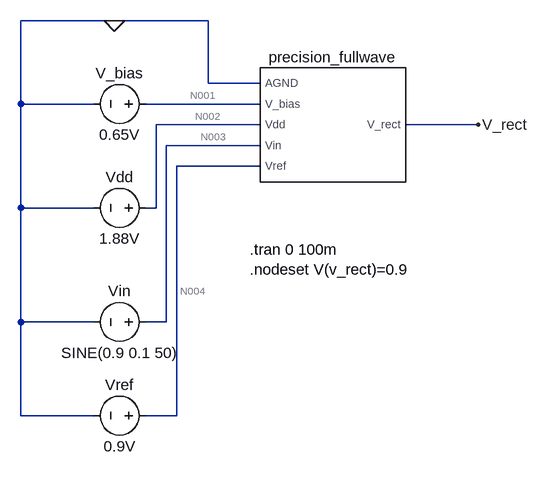
[diagram p0: schematic precision_fullwave_test.asc]
precision_fullwave_test.asc, the LTspice schematic file:
Version 4.1
SHEET 1 880 704
WIRE -112 32 -256 32
WIRE 32 32 -112 32
WIRE 32 128 32 32
WIRE 112 128 32 128
WIRE -256 160 -256 32
WIRE -144 160 -256 160
WIRE 112 160 -64 160
WIRE 112 192 -48 192
WIRE 448 192 336 192
WIRE 112 224 -32 224
WIRE 112 256 -16 256
WIRE -256 320 -256 160
WIRE -144 320 -256 320
WIRE -48 320 -48 192
WIRE -48 320 -64 320
WIRE -256 496 -256 320
WIRE -144 496 -256 496
WIRE -32 496 -32 224
WIRE -32 496 -64 496
WIRE -256 640 -256 496
WIRE -144 640 -256 640
WIRE -16 640 -16 256
WIRE -16 640 -64 640
FLAG -112 32 0
FLAG 448 192 V_rect
SYMBOL precision_fullwave 224 192 R0
SYMATTR InstName precision_fullwave
SYMBOL voltage -48 160 R90
WINDOW 0 -32 56 VBottom 2
WINDOW 3 32 56 VTop 2
SYMATTR InstName V_bias
SYMATTR Value 0.65V
SYMBOL voltage -48 320 R90
WINDOW 0 -32 56 VBottom 2
WINDOW 3 32 56 VTop 2
SYMATTR InstName Vdd
SYMATTR Value 1.88V
SYMBOL voltage -48 496 R90
WINDOW 0 -32 56 VBottom 2
WINDOW 3 32 56 VTop 2
WINDOW 123 0 0 Left 0
WINDOW 39 0 0 Left 0
SYMATTR InstName Vin
SYMATTR Value SINE(0.9 0.1 50)
SYMBOL voltage -48 640 R90
WINDOW 0 -32 56 VBottom 2
WINDOW 3 32 56 VTop 2
SYMATTR InstName Vref
SYMATTR Value 0.9V
TEXT 96 384 Left 2 !.tran 0 100m\n.nodeset V(v_rect)=0.9

The netlist it stands for:
* precision_fullwave_test.asc
X§precision_fullwave 0 N001 N002 N003 N004 V_rect precision_fullwave  ; pins AGND V_bias Vdd Vin Vref V_rect
V_bias N001 0 0.65V
Vdd N002 0 1.88V
Vin N003 0 SINE(0.9 0.1 50)
Vref N004 0 0.9V
.tran 0 100m
.nodeset V(v_rect)=0.9
.backanno
.end

* Results of the author's LTspice run, read from the files saved beside the schematic
* Operating Point, zero values left out:
*   V(n001) = 650 mV
*   V(n002) = 1.88 V
*   V(n003) = 900 mV
*   V(n004) = 900 mV
*   V(v_rect) = 906.8 mV
*   I(Vdd) = -646.7 nA
*   I(Vref) = 6.797 nA
*   Ix(precision_fullwave:agnd) = -639.9 nA
*   Ix(precision_fullwave:vdd) = 646.7 nA
*   Ix(precision_fullwave:vref) = -6.797 nA
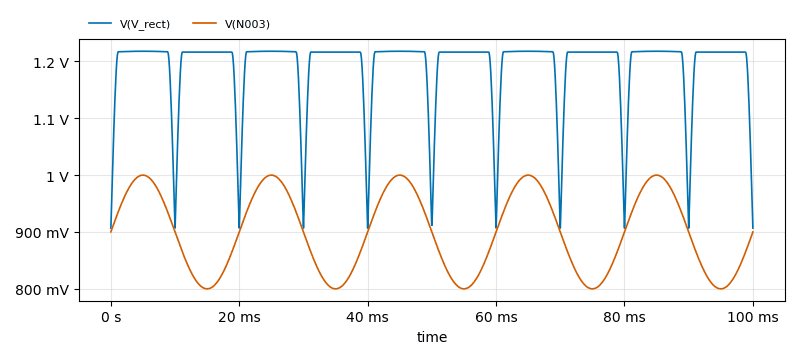
[diagram p1: Transient Analysis of precision_fullwave_test.asc, plotted from the saved traces]
* Transient Analysis, 1 run:
*   V(V_rect): min 906.8 mV, max 1.218 V, average 1.189 V, rms 1.191 V, last 906.8 mV
*   V(N003): min 800 mV, max 1 V, average 900 mV, rms 902.8 mV, last 900 mV